# EasyEDA schematic easyeda_dice.json
TITLE: Rico Coelen; REV: 1.0; Date: 2023-03-06; Sheet: 1/1; Company: Wanted5Games
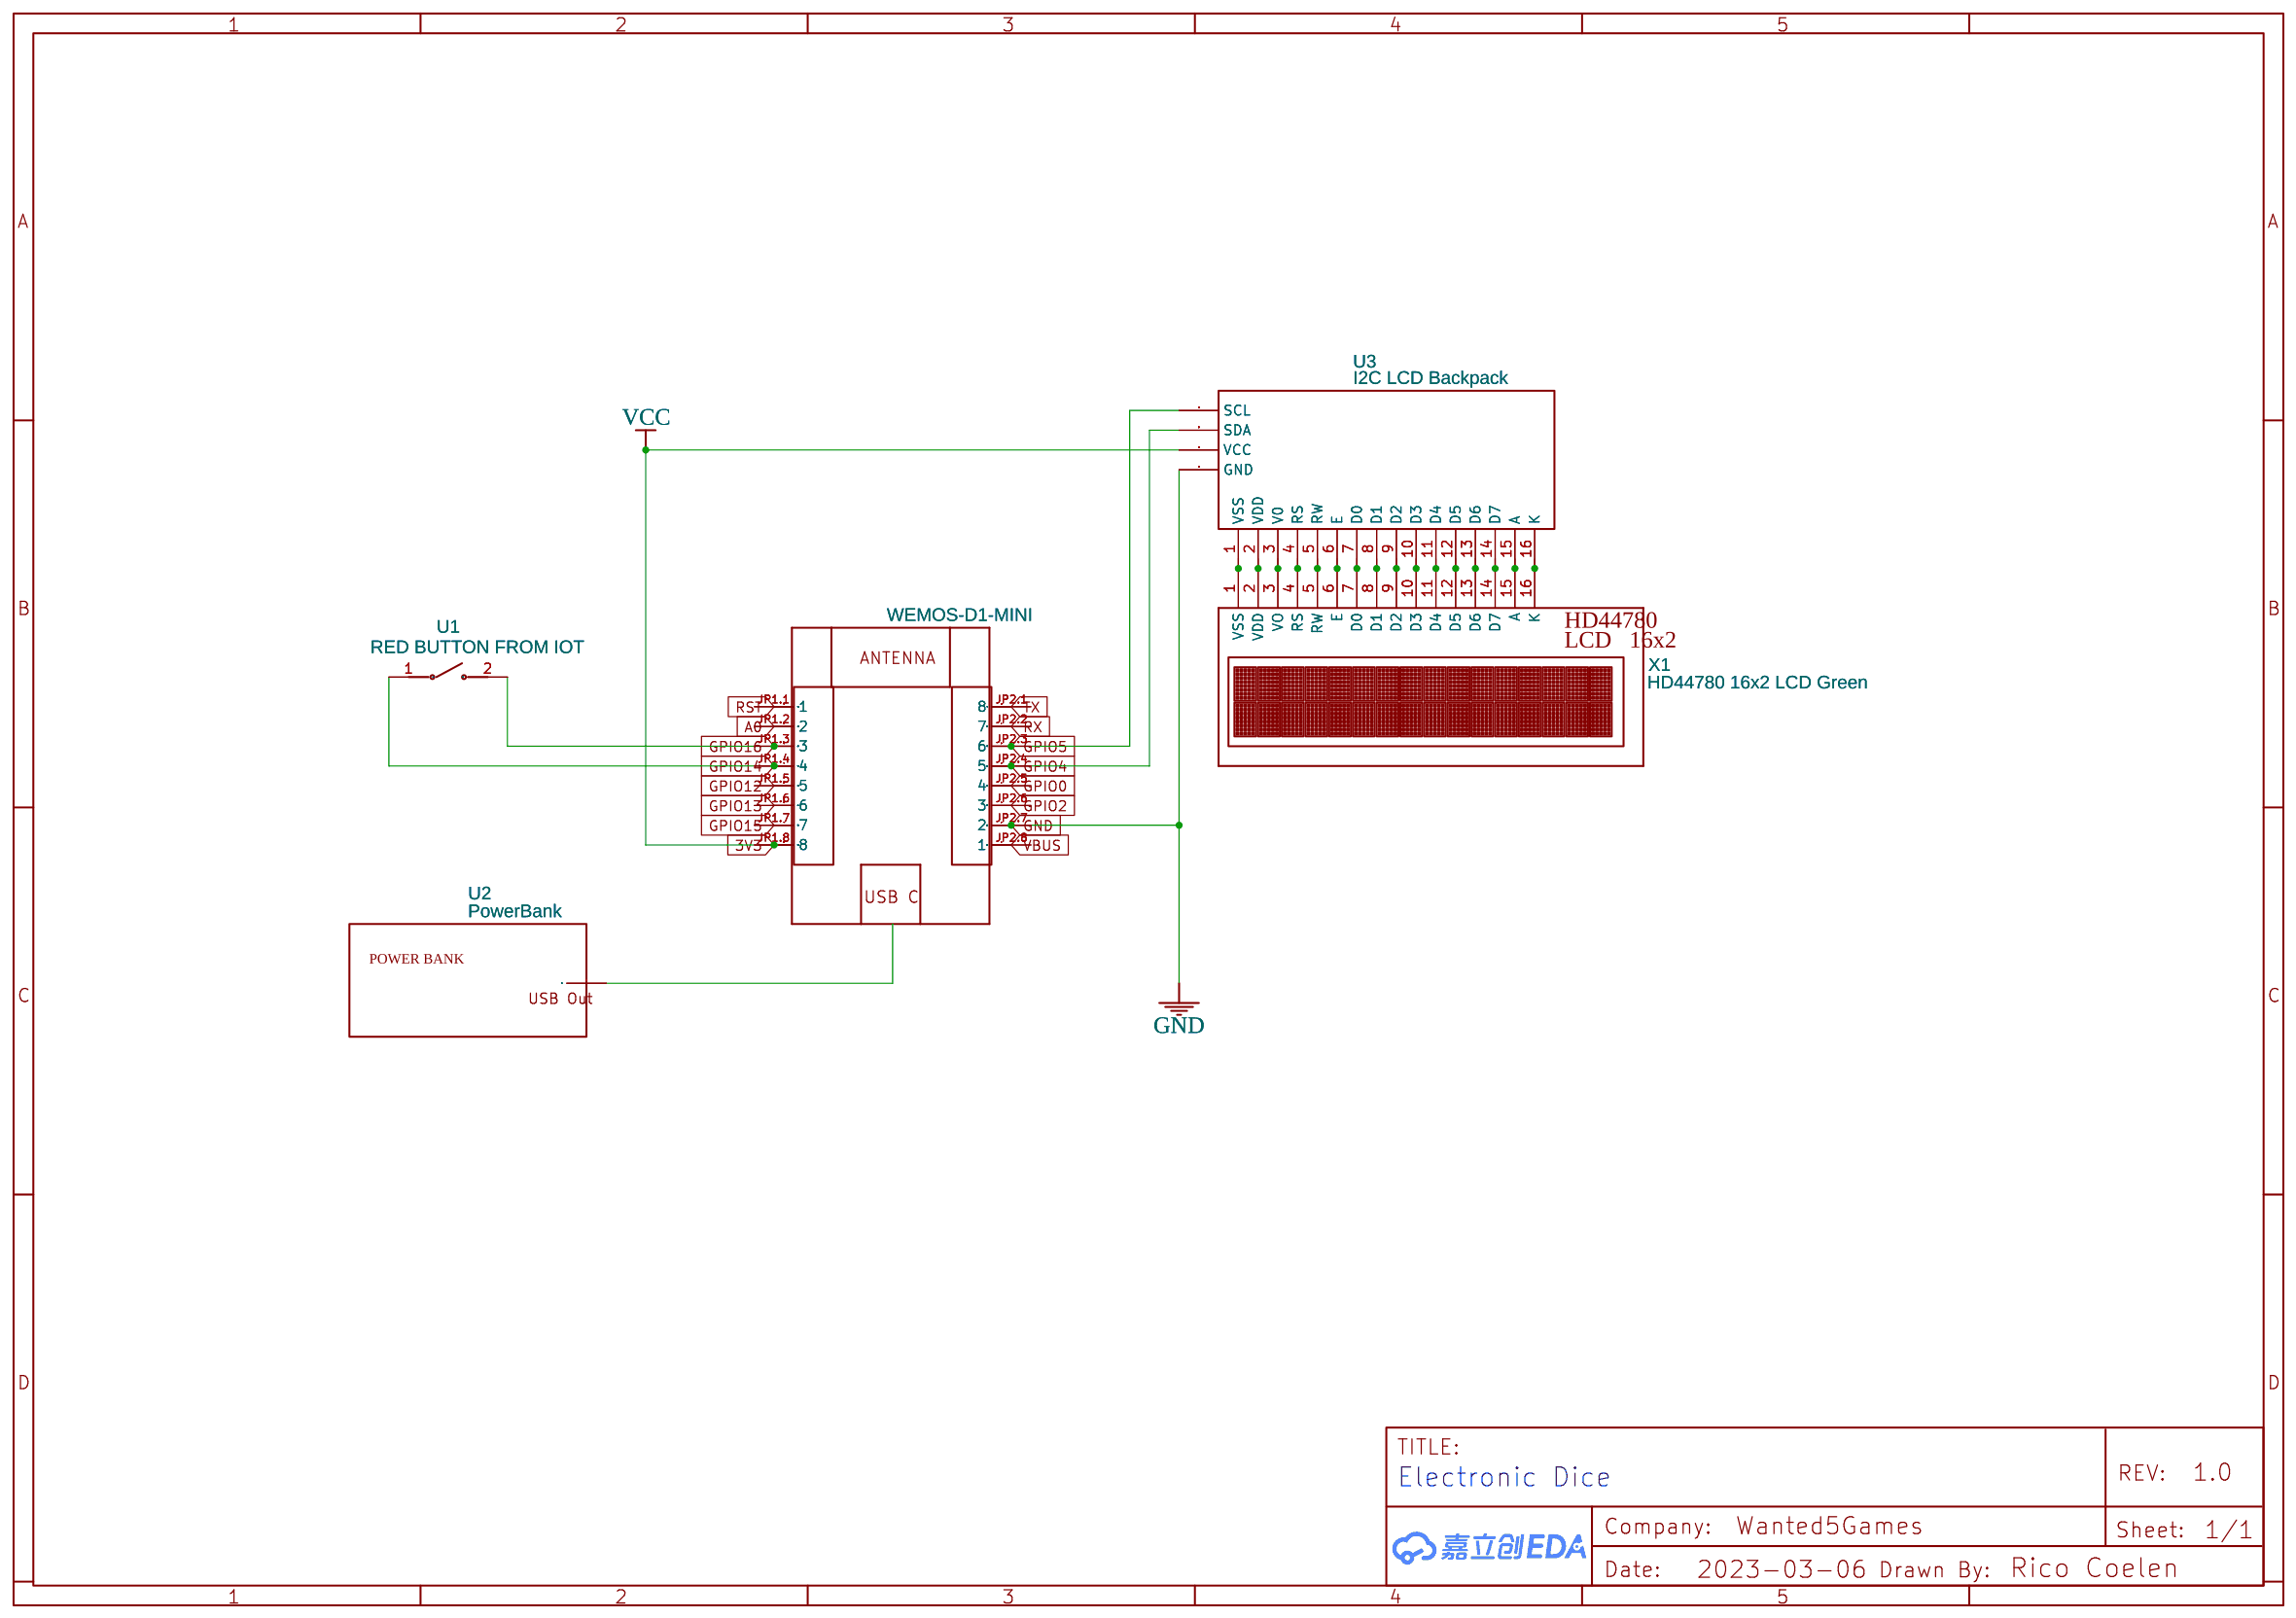
[diagram p0: schematic sheet]

## Parts
1  WEMOS-D1-MINI  [WEMOS-D1-MINI]
H1  HDR-F-2.54_1x8  [HDR-F-2.54_1X8]
H2  HDR-F-2.54_1x8  [HDR-F-2.54_1X8]
U1  RED BUTTON FROM IOT  [SW-SMD_L3.9-W2.9-LS4.9-L]
U2  PowerBank
U3  I2C LCD Backpack  [I2C LCD BACKPACK]
X1  HD44780 16x2 LCD Green  [LCD1602]

## Library data of the parts
1 = WEMOS-D1-MINI: Contributor: Andyrock
H1 H2 = HDR-F-2.54_1x8: Supplier Part: C225505; Supplier: LCSC; Contributor: LCEDA_Lib
U1 = BUTTON: Supplier: LCSC; Supplier Part: C9900015607; Manufacturer: null; JLCPCB Part Class: Extended Part; Contributor: lcsc
U2 = PowerBank: Contributor: Rossi02
U3 = I2C LCD Backpack: Manufacturer Part: I2C Bus Converter; Contributor: Ron Mikulecky (Dirttraxx)
X1 = HD44780 16x2 LCD Green: Contributor: tjdelzeit; Manufacturer Part: HD44780U; Manufacturer: Hitachi

## Nets
3V3: H1.8 U3.18(VCC)
GND: H2.2 U3.17(GND)
VBUS: H2.1
A0: H1.2
GPIO0: H2.4
GPIO2: H2.3
GPIO4: H2.5 U3.19(SDA)
GPIO5: H2.6 U3.20(SCL)
GPIO12: H1.5
GPIO13: H1.6
GPIO14: H1.4 U1.1
GPIO15: H1.7
GPIO16: H1.3 U1.2
RST: H1.1
RX: H2.7
TX: H2.8
Net-(U3-1): U3.1(VSS) X1.1(VSS)
Net-(U3-2): U3.2(VDD) X1.2(VDD)
Net-(U3-3): U3.3(V0) X1.3(VO)
Net-(U3-4): U3.4(RS) X1.4(RS)
Net-(U3-5): U3.5(RW) X1.5(RW)
Net-(U3-6): U3.6(E) X1.6(E)
Net-(U3-7): U3.7(D0) X1.7(D0)
Net-(U3-8): U3.8(D1) X1.8(D1)
Net-(U3-9): U3.9(D2) X1.9(D2)
Net-(U3-10): U3.10(D3) X1.10(D3)
Net-(U3-11): U3.11(D4) X1.11(D4)
Net-(U3-12): U3.12(D5) X1.12(D5)
Net-(U3-13): U3.13(D6) X1.13(D6)
Net-(U3-14): U3.14(D7) X1.14(D7)
Net-(U3-15): U3.15(A) X1.15(A)
Net-(U3-16): U3.16(K) X1.16(K)

Not connected (* = marked no-connect by the designer): 1 JP1.1(RST) JP1.2(A0) JP1.3(D0) JP1.4(D5) JP1.5(D6) JP1.6(D7) JP1.7(D8) JP1.8(3V3) JP2.1(TX) JP2.2(RX) JP2.3(D1) JP2.4(D2) JP2.5(D3) JP2.6(D4) JP2.7(GND) JP2.8(5V); U2 1

## Notes on the sheet
- Electronic Dice
